# Altium schematic sheet Sheet1.SchDoc
size A4
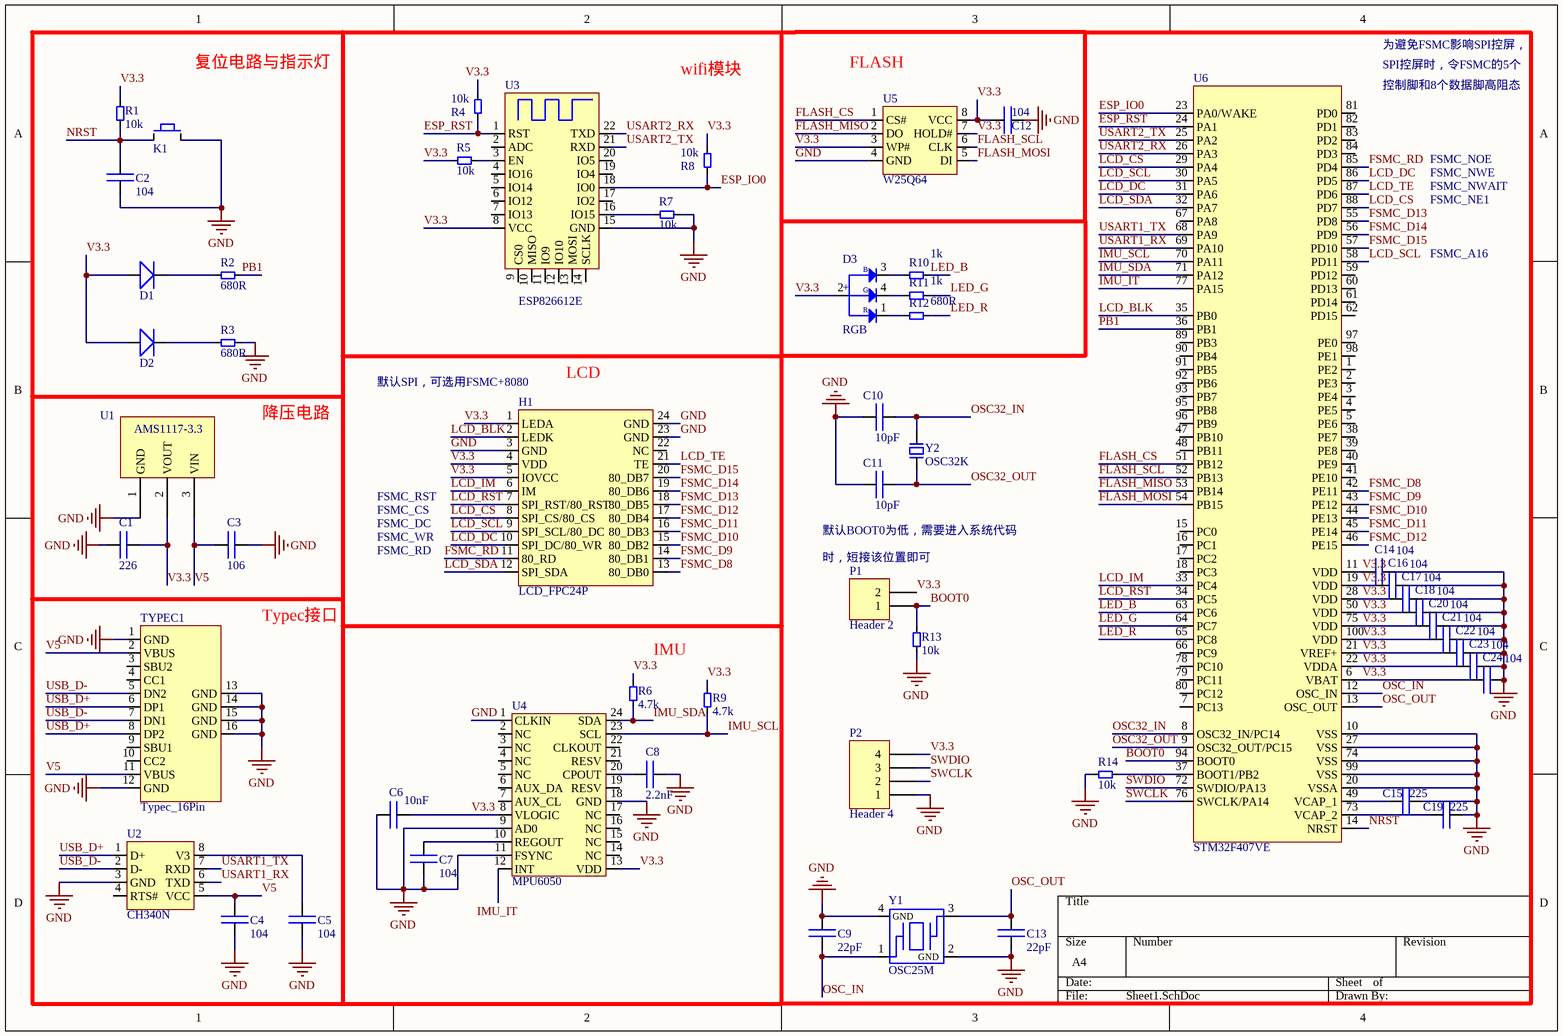
[diagram p0: Sheet1.SchDoc]

## Parts
C1  226  [0805C]
C2  104  [0805C]
C3  106  [0805C]
C4  104  [0805C]
C5  104  [0805C]
C6  10nF  [0805C]
C7  104  [0805C]
C8  2.2nF  [0805C]
C9  22pF  [0805C]
C10  10pF  [0805C]
C11  10pF  [0805C]
C12  104  [0805C]
C13  22pF  [0805C]
C14  104  [0805C]
C15  225  [0805C]
C16  104  [0805C]
C17  104  [0805C]
C18  104  [0805C]
C19  225  [0805C]
C20  104  [0805C]
C21  104  [0805C]
C22  104  [0805C]
C23  104  [0805C]
C24  104  [0805C]
D1  LED  [0805D]  (value not drawn)
D2  LED  [0805D]  (value not drawn)
D3  RGB  [RGB]
H1  LCD_FPC24P  [FPC24]
K1  KEY  [Key3x6x2.5]  (value not drawn)
P1  Header 2  [HDR1X2]
P2  Header 4  [HDR1X4]
R1  10k  [0805R]
R2  680R  [0805R]
R3  680R  [0805R]
R4  10k  [0805R]
R5  10k  [0805R]
R6  4.7k  [0805R]
R7  10k  [0805R]
R8  10k  [0805R]
R9  4.7k  [0805R]
R10  1k  [0805R]
R11  1k  [0805R]
R12  680R  [0805R]
R13  10k  [0805R]
R14  10k  [0805R]
TYPEC1  Typec_16Pin  [Typec_16Pin]
U1  AMS1117-3.3  [SOT-89]  (value not drawn)
U2  CH340N  [CH340N]
U3  ESP826612E  [ESP826612E]
U4  MPU6050  [MPU6050]
U5  W25Q64  [W25Q64]
U6  STM32F407VE  [STM32F407VET6]
Y1  OSC25M  [OSC25M]
Y2  OSC32K  [OSC32K]

## Nets
GND: C1.2 C2.1 C3.1 C4.1 C5.1 C6.2 C7.2 C8.2 C9.1 C10.1 C11.1 C12.1 C13.2 C14.1 C15.1 C16.1 C17.1 C18.1 C19.1 C20.1 C21.1 C22.1 C23.1 C24.1 H1.3(GND) H1.23(GND) H1.24(GND) K1.2 P2.1 R3.1 R7.1 R13.1 R14.1 TYPEC1.1(GND) TYPEC1.12(GND) TYPEC1.13(GND) TYPEC1.14(GND) TYPEC1.15(GND) TYPEC1.16(GND) U1.1(GND) U2.3(GND) U3.15(GND) U4.1(CLKIN) U4.9(AD0) U4.11(FSYNC) U4.18(GND) U5.4(GND) U6.10(VSS) U6.20(VSSA) U6.27(VSS) U6.74(VSS) U6.99(VSS) Y1.2(GND) Y1.4(GND)
BOOT0: P1.1 R13.2 U6.94(BOOT0)
ESP_IO0: R8.1 U3.18(IO0) U6.23(PA0/WAKE)
ESP_RST: R4.1 U3.1(RST) U6.24(PA1)
FLASH_CS: U5.1(CS#) U6.51(PB12)
FLASH_MISO: U5.2(DO) U6.53(PB14)
FLASH_MOSI: U5.5(DI) U6.54(PB15)
FLASH_SCL: U5.6(CLK) U6.52(PB13)
FSMC_D8: H1.13(80_DB0) U6.42(PE11)
FSMC_D9: H1.14(80_DB1) U6.43(PE12)
FSMC_D10: H1.15(80_DB2) U6.44(PE13)
FSMC_D11: H1.16(80_DB3) U6.45(PE14)
FSMC_D12: H1.17(80_DB4) U6.46(PE15)
FSMC_D13: H1.18(80_DB5) U6.55(PD8)
FSMC_D14: H1.19(80_DB6) U6.56(PD9)
FSMC_D15: H1.20(80_DB7) U6.57(PD10)
FSMC_RD: H1.11(80_RD) U6.85(PD4)
IMU_IT: U4.12(INT) U6.77(PA15)
IMU_SCL: R9.1 U4.23(SCL) U6.70(PA11)
IMU_SDA: R6.1 U4.24(SDA) U6.71(PA12)
LCD_BLK: H1.2(LEDK) U6.35(PB0)
LCD_CS: H1.8(SPI_CS/80_CS) U6.29(PA4) U6.88(PD7)
LCD_DC: H1.10(SPI_DC/80_WR) U6.31(PA6) U6.86(PD5)
LCD_IM: H1.6(IM) U6.33(PC4)
LCD_RST: H1.7(SPI_RST/80_RST) U6.34(PC5)
LCD_SCL: H1.9(SPI_SCL/80_DC) U6.30(PA5) U6.58(PD11)
LCD_SDA: H1.12(SPI_SDA) U6.32(PA7)
LCD_TE: H1.21(TE) U6.87(PD6)
LED_B: R10.1 U6.63(PC6)
LED_G: R11.1 U6.64(PC7)
LED_R: R12.1 U6.65(PC8)
NRST: C2.2 K1.1 R1.1 U6.14(NRST)
OSC32_IN: C10.2 U6.8(OSC32_IN/PC14) Y2.2
OSC32_OUT: C11.2 U6.9(OSC32_OUT/PC15) Y2.1
OSC_IN: C9.2 U6.12(OSC_IN) Y1.1
OSC_OUT: C13.1 U6.13(OSC_OUT) Y1.3
PB1: R2.1 U6.36(PB1)
SWCLK: P2.2 U6.76(SWCLK/PA14)
SWDIO: P2.3 U6.72(SWDIO/PA13)
USART1_RX: U2.6(TXD) U6.69(PA10)
USART1_TX: U2.7(RXD) U6.68(PA9)
USART2_RX: U3.22(TXD) U6.26(PA3)
USART2_TX: U3.21(RXD) U6.25(PA2)
USB_D+: TYPEC1.6(DP1) TYPEC1.8(DP2) U2.1(D+)
USB_D-: TYPEC1.5(DN2) TYPEC1.7(DN1) U2.2(D-)
V3.3: C1.1 C6.1 C12.2 C14.2 C16.2 C17.2 C18.2 C20.2 C21.2 C22.2 C23.2 C24.2 D1.2 D2.2 D3.2 H1.1(LEDA) H1.4(VDD) H1.5(IOVCC) P1.2 P2.4 R1.2 R4.2 R5.2 R6.2 R8.2 R9.2 U1.2(VOUT) U3.8(VCC) U4.8(VLOGIC) U4.13(VDD) U5.3(WP#) U5.7(HOLD#) U5.8(VCC) U6.6(VBAT) U6.11(VDD) U6.19(VDD) U6.21(VREF+) U6.22(VDDA) U6.28(VDD) U6.50(VDD) U6.75(VDD) U6.100(VDD)
V5: C3.2 C4.2 TYPEC1.2(VBUS) TYPEC1.11(VBUS) U1.3(VIN) U2.5(VCC)
NetC5_2: C5.2 U2.8(V3)
NetC7_1: C7.1 U4.10(REGOUT)
NetC8_1: C8.1 U4.20(CPOUT)
NetC15_2: C15.2 U6.49(VCAP_1)
NetC19_2: C19.2 U6.73(VCAP_2)
NetD1_1: D1.1 R2.2
NetD2_1: D2.1 R3.2
NetD3_1: D3.1 R12.2
NetD3_3: D3.3 R10.2
NetD3_4: D3.4 R11.2
NetR5_1: R5.1 U3.3(EN)
NetR7_2: R7.2 U3.16(IO15)
NetR14_2: R14.2 U6.37(BOOT1/PB2)

Not connected (* = marked no-connect by the designer): H1 22(NC); TYPEC1 3(SBU2) 4(CC1) 9(SBU1) 10(CC2); U2 4(RTS#); U3 2(ADC) 4(IO16) 5(IO14) 6(IO12) 7(IO13) 9(CS0) 10(MISO) 11(IO9) 12(IO10) 13(MOSI) 14(SCLK) 17(IO2) 19(IO4) 20(IO5); U4 2(NC) 3(NC) 4(NC) 5(NC) 6(AUX_DA) 7(AUX_CL) 14(NC) 15(NC) 16(NC) 17(NC) 19(RESV) 21(RESV) 22(CLKOUT); U6 1(PE2) 2(PE3) 3(PE4) 4(PE5) 5(PE6) 7(PC13) 15(PC0) 16(PC1) 17(PC2) 18(PC3) 38(PE7) 39(PE8) 40(PE9) 41(PE10) 47(PB10) 48(PB11) 59(PD12) 60(PD13) 61(PD14) 62(PD15) 66(PC9) 67(PA8) 78(PC10) 79(PC11) 80(PC12) 81(PD0) 82(PD1) 83(PD2) 84(PD3) 89(PB3) 90(PB4) 91(PB5) 92(PB6) 93(PB7) 95(PB8) 96(PB9) 97(PE0) 98(PE1)

## Notes on the sheet
- 复位电路与指示灯
- wifi模块
- (near U5) FLASH
- 为避免FSMC影响SPI控屏，
- SPI控屏时，令FSMC的5个
- (near U6) 控制脚和8个数据脚高阻态
- FSMC_NOE
- FSMC_NWE
- FSMC_NE1
- FSMC_NWAIT
- FSMC_A16
- (near H1) 默认SPI，可选用FSMC+8080
- (near H1) LCD
- 降压电路
- FSMC_RST
- FSMC_CS
- FSMC_DC
- FSMC_WR
- FSMC_RD
- 默认BOOT0为低，需要进入系统代码
- (near P1) 时，短接该位置即可
- Typec接口
- IMU
- (in symbol RGB) B; +; G; R

## Library data of the parts
C1-C24 = CAP: 电容
D1 D2 = LED: LED灯
K1 = KEY: 按键
P1 = Header 2: Header, 2-Pin; LatestRevisionDate: 17-Jul-2002; LatestRevisionNote: Re-released for DXP Platform.; Publisher: Altium Limited
P2 = Header 4: Header, 4-Pin; LatestRevisionDate: 17-Jul-2002; LatestRevisionNote: Re-released for DXP Platform.; Publisher: Altium Limited
R1-R14 = RES: 电阻
U1 = AMS1117-3.3: IC
U6 = STM32F407VET6